# Altium schematic sheet Teensy32.SchDoc: Micro-Computer Controls
size Letter; DocumentNumber: 1; Revision: 1; SheetNumber: 1; SheetTotal: 6
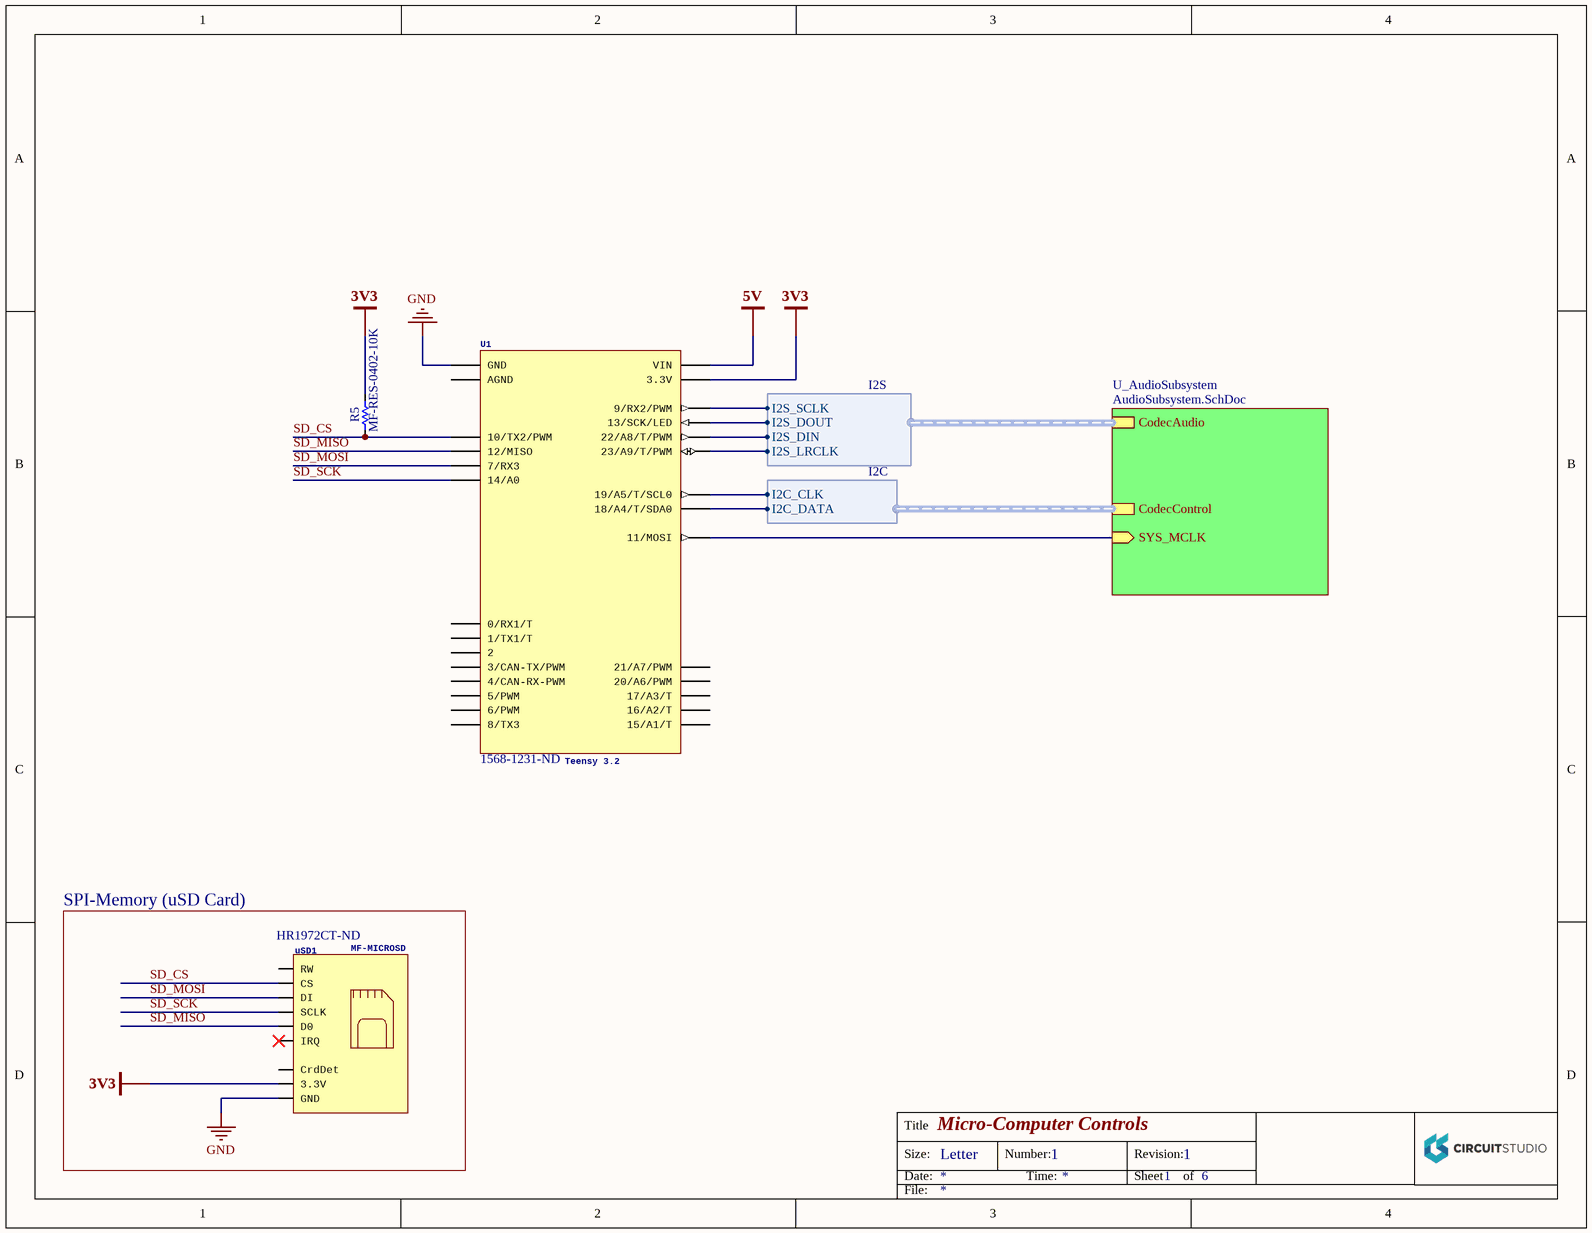
[diagram p0: Teensy32.SchDoc]

## Parts
R5  MF-RES-0402-10K  [R0402L]
U1  Teensy 3.2  Supplier Part Number 1: 1568-1231-ND  [TEENSY_3.0-3.2&LC_DIL]
uSD1  MF-MICROSD  Supplier Part Number 1: HR1972CT-ND  [MF-MICROSD]

## Blocks framed on the sheet
SPI-Memory (uSD Card): uSD1

## Sub-sheets
U_AudioSubsystem = AudioSubsystem.SchDoc: CodecAudio (harness I2S), SYS_MCLK (in), CodecControl (harness I2C)

## Harnesses
I2S: I2S_DIN, I2S_DOUT, I2S_LRCLK, I2S_SCLK
I2C: I2C_CLK, I2C_DATA

## Nets
3V3: R5.2 U1.3.3V uSD1.3.3V
5V: U1.VIN
GND: U1.GND uSD1.GND
SD_CS: R5.1 U1.10(10/TX2/PWM) uSD1.2(CS)
SD_MISO: U1.12(12/MISO) uSD1.7(D0)
SD_MOSI: U1.7(7/RX3) uSD1.3(DI)
SD_SCK: U1.14/A0 uSD1.5(SCLK)
NetU1_9: U1.9(9/RX2/PWM) ; sheet U_AudioSubsystem/CodecAudio.I2S_SCLK
NetU1_11: U1.11(11/MOSI) ; sheet U_AudioSubsystem/SYS_MCLK
NetU1_13: U1.13(13/SCK/LED) ; sheet U_AudioSubsystem/CodecAudio.I2S_DOUT
NetU1_18/A4: U1.18/A4(18/A4/T/SDA0) ; sheet U_AudioSubsystem/CodecControl.I2C_DATA
NetU1_19/A5: U1.19/A5(19/A5/T/SCL0) ; sheet U_AudioSubsystem/CodecControl.I2C_CLK
NetU1_22/A8: U1.22/A8(22/A8/T/PWM) ; sheet U_AudioSubsystem/CodecAudio.I2S_DIN
NetU1_23/A9: U1.23/A9(23/A9/T/PWM) ; sheet U_AudioSubsystem/CodecAudio.I2S_LRCLK

Not connected (* = marked no-connect by the designer): U1 0(0/RX1/T) 1(1/TX1/T) 2 3(3/CAN-TX/PWM) 4(4/CAN-RX-PWM) 5(5/PWM) 6(6/PWM) 8(8/TX3) 15/A1(15/A1/T) 16/A2(16/A2/T) 17/A3(17/A3/T) 20/A6(20/A6/PWM) 21/A7(21/A7/PWM) AGND; uSD1 1(RW) 8(IRQ)* CrdDet

## Notes on the sheet
- Title
- Size:
- Date:
- Letter
- Number:
- Time:
- Revision:
- Sheet
- of
- File:

## Library data of the parts
R5 = RESISTOR: HOUSEPART: YES; POPULATE: 1; VOLTAGE: 50 V; WATTAGE: 100mW; VALUE: 1K; SymbolName_1: RESISTOR; LibraryName: MF_Passives; DeviceSetName: RESISTOR; MF_PARTNUM: MF-RES-0402-10K; Supplier 1: Digi-Key; Supplier Part Number 1: P1.0KJCT-ND
U1 = TEENSY 3.2: HOUSEPART: NO; Processor: MK20DX256VLH7; Clock Speed: 72MHz; Flash: 256 kb; RAM: 64 kb; DMA Channels: 4; USB: Yes; ADCs: 2; DeviceName: Teensy 3.2; URL: https://www.pjrc.com/teensy/teensy31.html; Supplier 1: Digi-Key
uSD1 = MacroFab uSD card slot: Actual Device is 4UCONN microSD; HOUSEPART: YES; SymbolName_1: SD_CARD; DeviceName: _MICRO_RIGHT; DeviceSetName: SD_CARD_SLOT; POPULATE: 1; MPN: MF-MICROSD; URL: https://factory.macrofab.com/part/MF-MICROSD; Supplier 1: Digi-Key